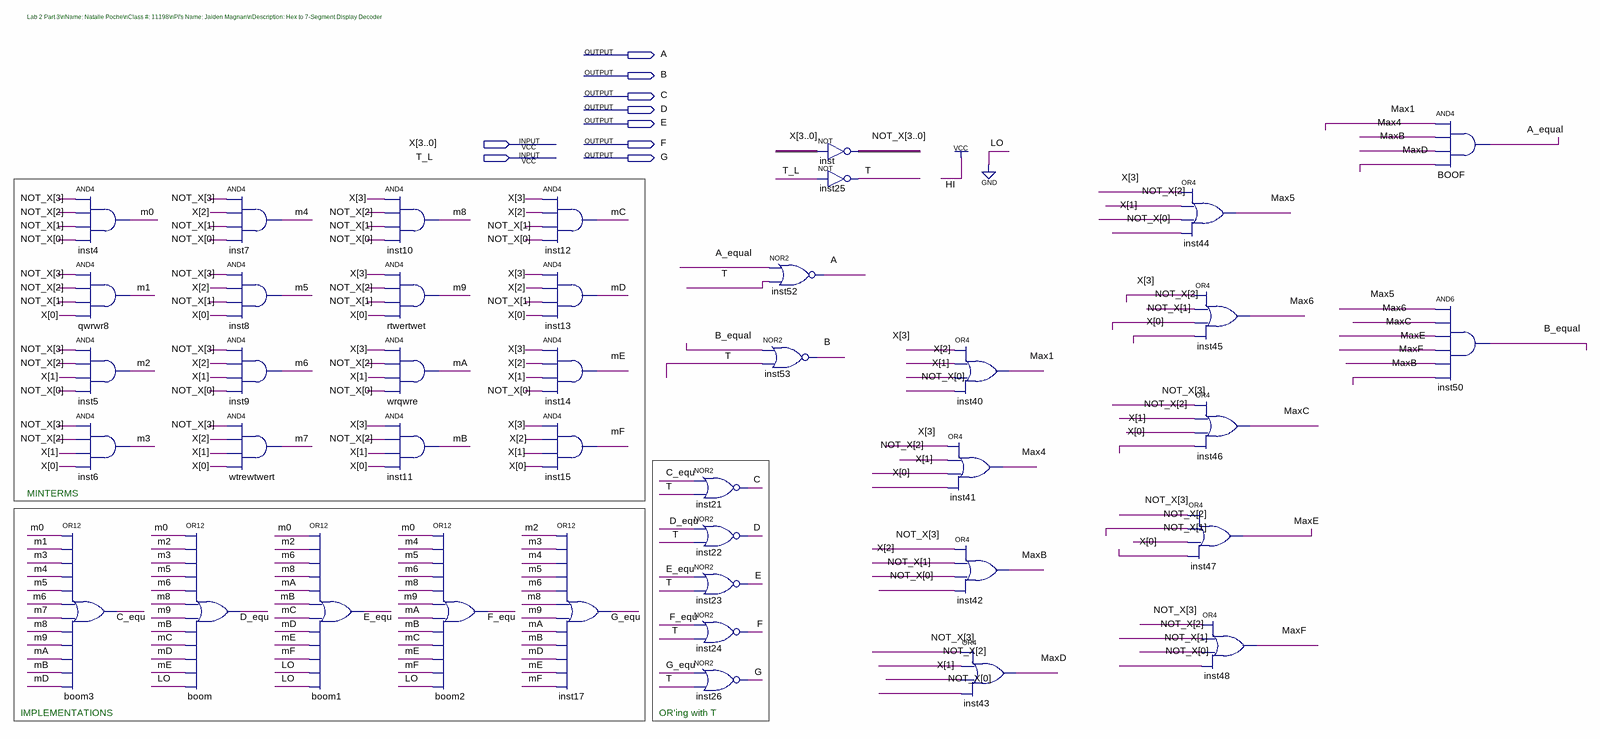
[diagram p0: schematic sheet]
// Quartus schematic lab2_decoder.bdf as structural Verilog: 41 symbols, 9 pins
module lab2_decoder (
  input  [3:0] X,
  input  T_L,
  output A,
  output B,
  output C,
  output D,
  output E,
  output F,
  output G
);

  wire A_equal, B_equal, C_equ, D_equ, E_equ, F_equ, G_equ, m0, m1, m2, m3, m4, m5, m6, m7, m8, m9, mA, Max1,
       Max4, Max5, Max6, MaxB, MaxC, MaxD, MaxE, MaxF, mB, mC, mD, mE, mF, T;
  wire [3:0] NOT_X;

  and inst4 (m0, NOT_X[3], NOT_X[2], NOT_X[1], NOT_X[0]);
  and qwrwr8 (m1, NOT_X[3], NOT_X[2], NOT_X[1], X[0]);
  and inst5 (m2, NOT_X[3], NOT_X[2], X[1], NOT_X[0]);
  and inst6 (m3, NOT_X[3], NOT_X[2], X[1], X[0]);
  or boom3 (C_equ, m0, m1, m3, m4, m5, m6, m7, m8, m9, mA, mB, mD);
  or boom (D_equ, m0, m2, m3, m5, m6, m8, m9, mB, mC, mD, mE, 1'b0);
  and inst7 (m4, NOT_X[3], X[2], NOT_X[1], NOT_X[0]);
  and inst8 (m5, NOT_X[3], X[2], NOT_X[1], X[0]);
  and inst9 (m6, NOT_X[3], X[2], X[1], NOT_X[0]);
  and wtrewtwert (m7, NOT_X[3], X[2], X[1], X[0]);
  or boom1 (E_equ, m0, m2, m6, m8, mA, mB, mC, mD, mE, mF, 1'b0, 1'b0);
  and inst10 (m8, X[3], NOT_X[2], NOT_X[1], NOT_X[0]);
  and rtwertwet (m9, X[3], NOT_X[2], NOT_X[1], X[0]);
  and wrqwre (mA, X[3], NOT_X[2], X[1], NOT_X[0]);
  and inst11 (mB, X[3], NOT_X[2], X[1], X[0]);
  or boom2 (F_equ, m0, m4, m5, m6, m8, m9, mA, mB, mC, mE, mF, 1'b0);
  and inst12 (mC, X[3], X[2], NOT_X[1], NOT_X[0]);
  and inst13 (mD, X[3], X[2], NOT_X[1], X[0]);
  and inst14 (mE, X[3], X[2], X[1], NOT_X[0]);
  and inst15 (mF, X[3], X[2], X[1], X[0]);
  or inst17 (G_equ, m2, m3, m4, m5, m6, m8, m9, mA, mB, mD, mE, mF);
  nor inst21 (C, C_equ, T);
  nor inst22 (D, D_equ, T);
  nor inst23 (E, E_equ, T);
  nor inst24 (F, F_equ, T);
  nor inst26 (G, G_equ, T);
  nor inst52 (A, A_equal, T);
  nor inst53 (B, B_equal, T);
  assign NOT_X = ~X;  // NOT inst, 4 bits wide
  not inst25 (T, T_L);
  or inst40 (Max1, X[3], X[2], X[1], NOT_X[0]);
  or inst41 (Max4, X[3], NOT_X[2], X[1], X[0]);
  or inst42 (MaxB, NOT_X[3], X[2], NOT_X[1], NOT_X[0]);
  or inst43 (MaxD, NOT_X[3], NOT_X[2], X[1], NOT_X[0]);
  or inst44 (Max5, X[3], NOT_X[2], X[1], NOT_X[0]);
  or inst45 (Max6, X[3], NOT_X[2], NOT_X[1], X[0]);
  or inst46 (MaxC, NOT_X[3], NOT_X[2], X[1], X[0]);
  or inst47 (MaxE, NOT_X[3], NOT_X[2], NOT_X[1], X[0]);
  or inst48 (MaxF, NOT_X[3], NOT_X[2], NOT_X[1], NOT_X[0]);
  and BOOF (A_equal, Max1, Max4, MaxB, MaxD);
  and inst50 (B_equal, Max5, Max6, MaxC, MaxE, MaxF, MaxB);

  // Notes on the sheet:
  //   Lab 2 Part 3\nName: Natalie Poche\nClass #: 11198\nPI's Name: Jaiden Magnan\nDescription: Hex to 7-Segment Display Decoder
  //   MINTERMS
  //   IMPLEMENTATIONS
  //   OR'ing with T
endmodule
